# EAGLE schematic zikzak3-memswitch (EAGLE 6.4)
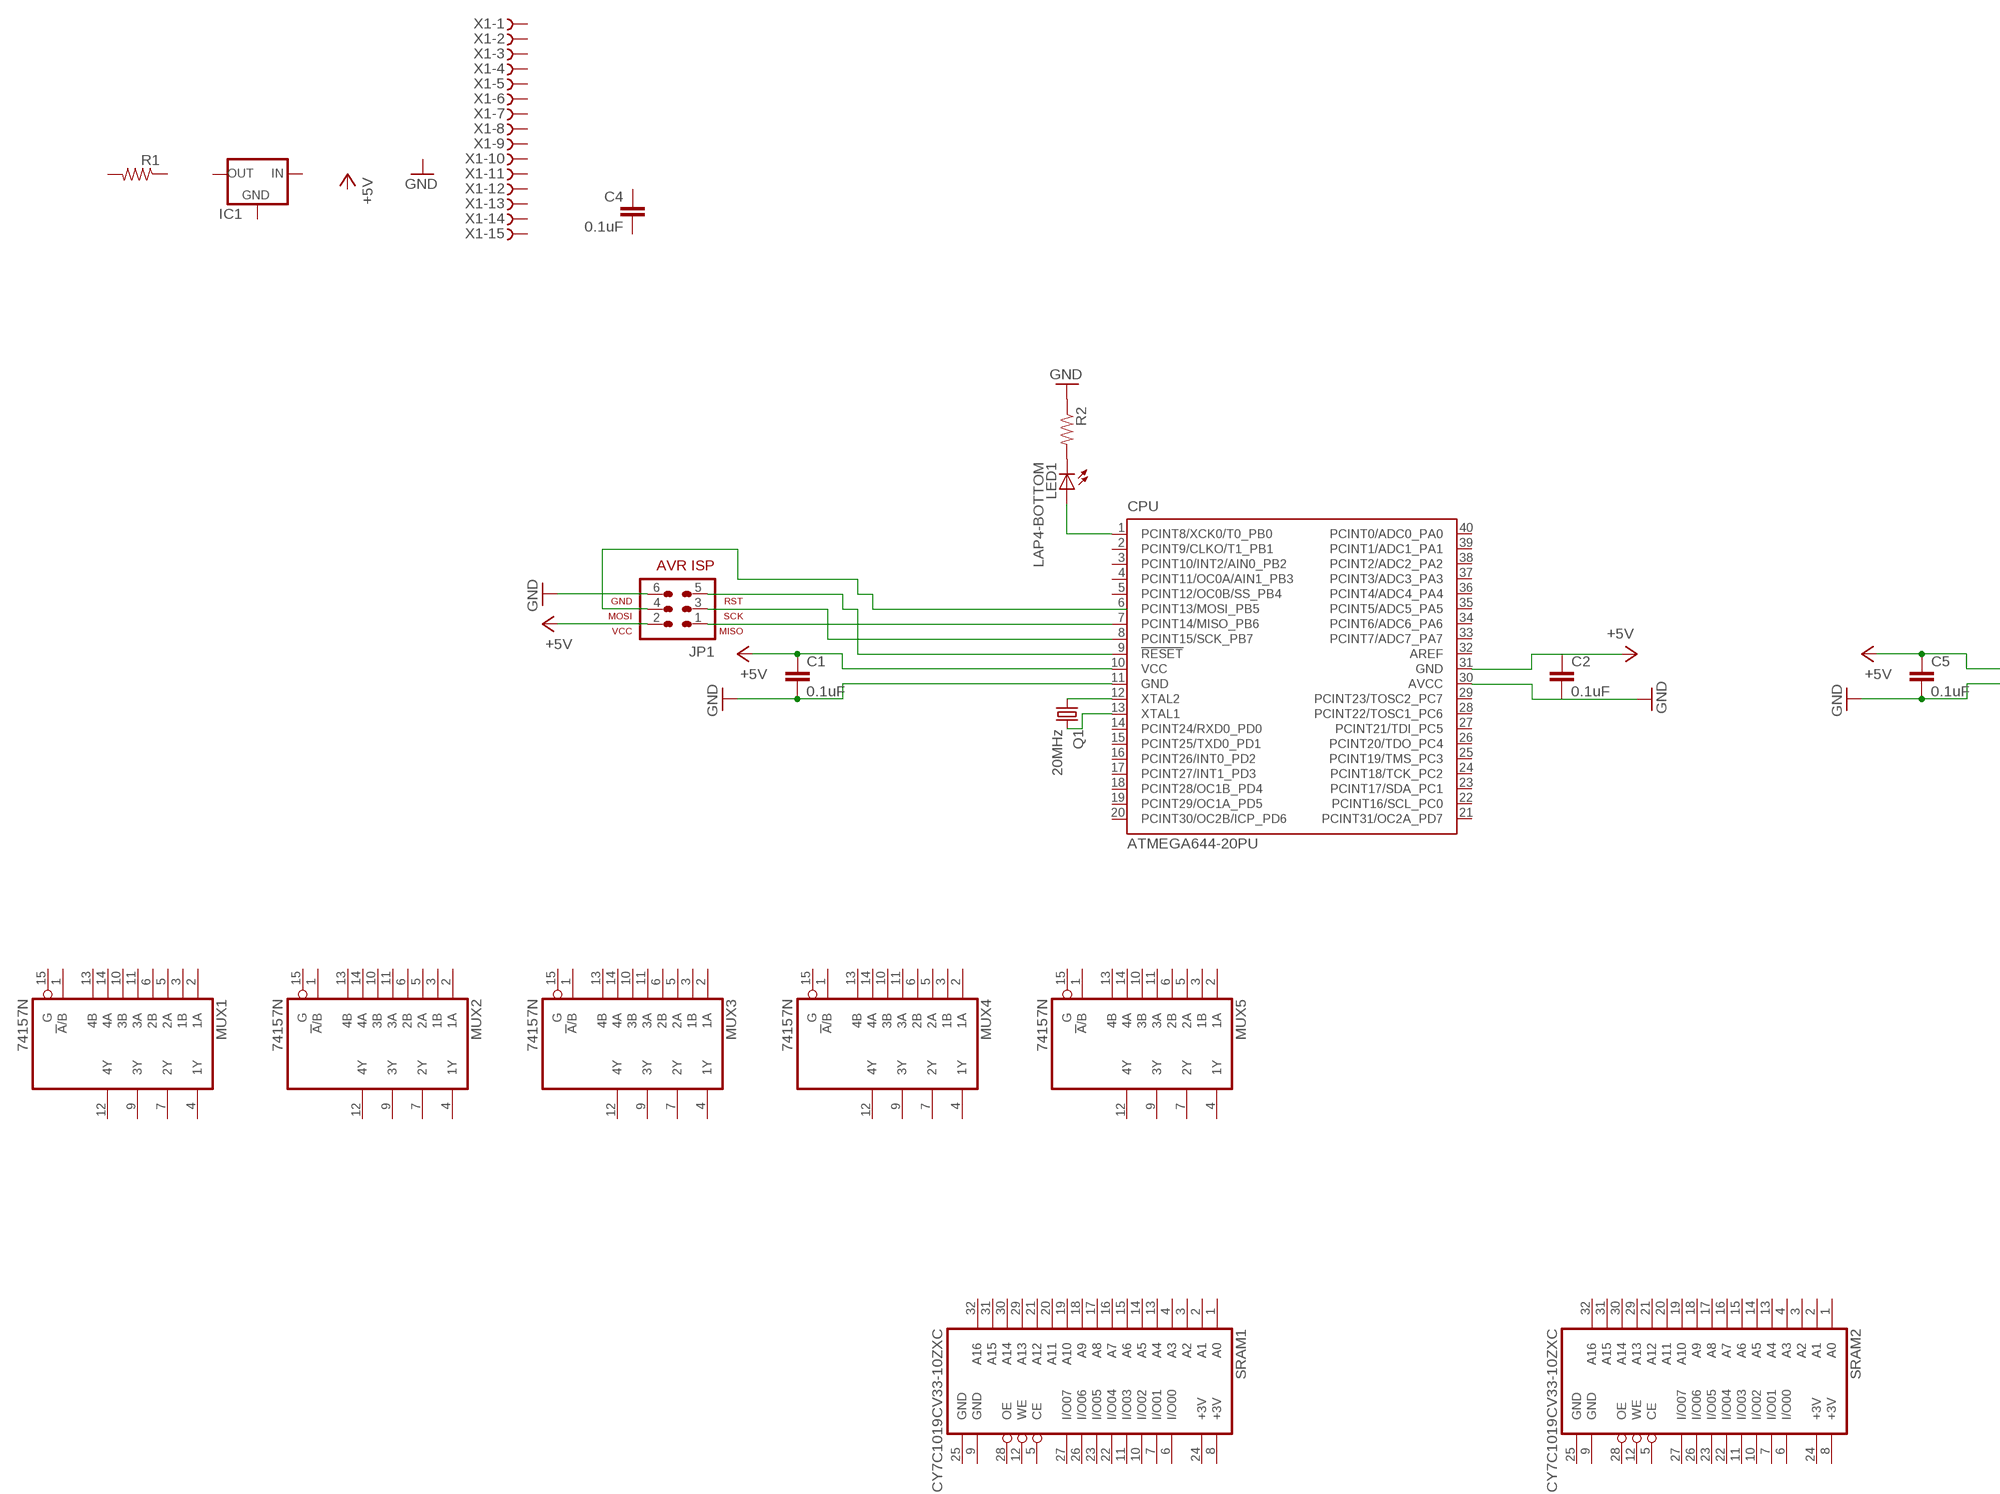
[diagram p0: schematic, sheet 1, part 1 of 2]
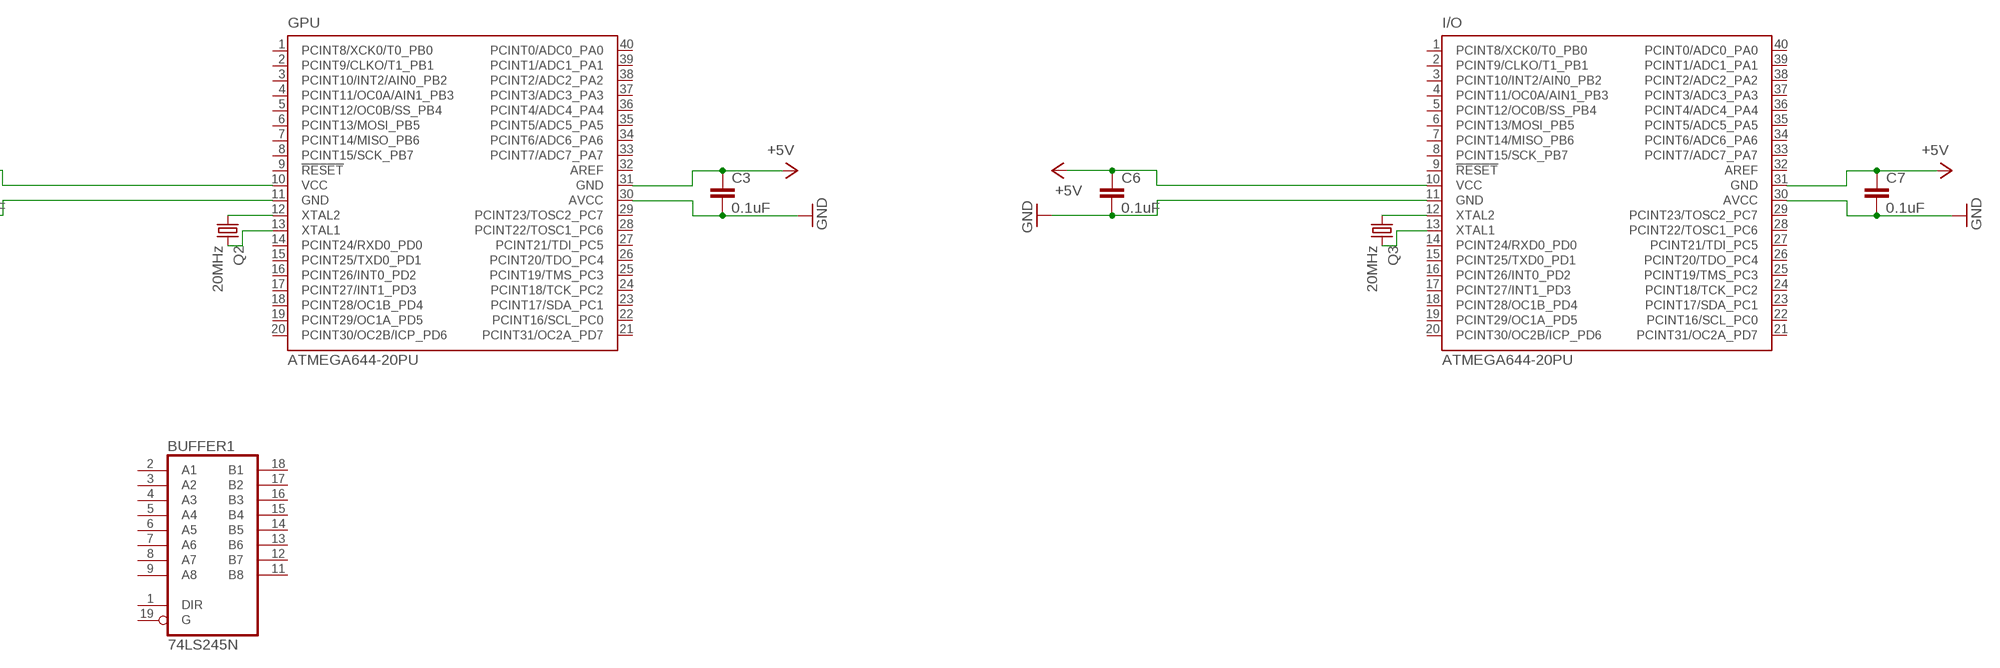
[diagram p1: schematic, sheet 1, part 2 of 2]

## Parts
BUFFER1  74LS245N  [DIL20]
C1  0.1uF  C2,5-3  [C2.5-3]
C2  0.1uF  C2,5-3  [C2.5-3]
C3  0.1uF  C2,5-3  [C2.5-3]
C4  0.1uF  C2,5-3  [C2.5-3]
C5  0.1uF  C2,5-3  [C2.5-3]
C6  0.1uF  C2,5-3  [C2.5-3]
C7  0.1uF  C2,5-3  [C2.5-3]
CPU  ATMEGA644-20PU  [DIL40]
GPU  ATMEGA644-20PU  [DIL40]
I/O  ATMEGA644-20PU  [DIL40]
IC1  78MXXL  [78MXXL]
JP1  AVR-ISP-6VERT  [AVR-ISP-6]
LED1  LAP4-BOTTOM  [P47F-BOTTOM]
MUX1  74157N  [DIL16]
MUX2  74157N  [DIL16]
MUX3  74157N  [DIL16]
MUX4  74157N  [DIL16]
MUX5  74157N  [DIL16]
Q1  20MHz  CRYSTALTC38H  [TC38H]
Q2  20MHz  CRYSTALTC38H  [TC38H]
Q3  20MHz  CRYSTALTC38H  [TC38H]
R1  R-US_0204/2V  [0204V]
R2  R-US_0204/2V  [0204V]
SRAM1  CY7C1019CV33-10ZXC  [TSOPII-32]
SRAM2  CY7C1019CV33-10ZXC  [TSOPII-32]
X1  F15HDVS  [HDF15V]

## Nets
+5V: C1.1 C3.1 C5.1 C6.1 C7.1 CPU.10(VCC) CPU.31(GND) GPU.10(VCC) GPU.31(GND) I/O.10(VCC) I/O.31(GND) JP1.2
GND: C1.2 C3.2 C5.2 C6.2 C7.2 CPU.11(GND) CPU.30(AVCC) GPU.11(GND) GPU.30(AVCC) I/O.11(GND) I/O.30(AVCC) JP1.6 R2.1
N$1: LED1.C R2.2
N$2: CPU.7(PCINT14/MISO_PB6) JP1.1
N$3: CPU.8(PCINT15/SCK_PB7) JP1.3
N$4: CPU.9(!RESET) JP1.5
N$5: CPU.12(XTAL2) Q1.1
N$6: CPU.13(XTAL1) Q1.2
N$7: CPU.1(PCINT8/XCK0/T0_PB0) LED1.A
N$8: JP1.4
N$9: GPU.12(XTAL2) Q2.1
N$10: GPU.13(XTAL1) Q2.2
N$11: I/O.12(XTAL2) Q3.1
N$12: I/O.13(XTAL1) Q3.2
Unconnected: BUFFER1.1(DIR) BUFFER1.2(A1) BUFFER1.3(A2) BUFFER1.4(A3) BUFFER1.5(A4) BUFFER1.6(A5) BUFFER1.7(A6) BUFFER1.8(A7) BUFFER1.9(A8) BUFFER1.11(B8) BUFFER1.12(B7) BUFFER1.13(B6) BUFFER1.14(B5) BUFFER1.15(B4) BUFFER1.16(B3) BUFFER1.17(B2) BUFFER1.18(B1) BUFFER1.19(G) C2.1 C2.2 C4.1 C4.2 CPU.2(PCINT9/CLKO/T1_PB1) CPU.3(PCINT10/INT2/AIN0_PB2) CPU.4(PCINT11/OC0A/AIN1_PB3) CPU.5(PCINT12/OC0B/SS_PB4) CPU.6(PCINT13/MOSI_PB5) CPU.14(PCINT24/RXD0_PD0) CPU.15(PCINT25/TXD0_PD1) CPU.16(PCINT26/INT0_PD2) CPU.17(PCINT27/INT1_PD3) CPU.18(PCINT28/OC1B_PD4) CPU.19(PCINT29/OC1A_PD5) CPU.20(PCINT30/OC2B/ICP_PD6) CPU.21(PCINT31/OC2A_PD7) CPU.22(PCINT16/SCL_PC0) CPU.23(PCINT17/SDA_PC1) CPU.24(PCINT18/TCK_PC2) CPU.25(PCINT19/TMS_PC3) CPU.26(PCINT20/TDO_PC4) CPU.27(PCINT21/TDI_PC5) CPU.28(PCINT22/TOSC1_PC6) CPU.29(PCINT23/TOSC2_PC7) CPU.32(AREF) CPU.33(PCINT7/ADC7_PA7) CPU.34(PCINT6/ADC6_PA6) CPU.35(PCINT5/ADC5_PA5) CPU.36(PCINT4/ADC4_PA4) CPU.37(PCINT3/ADC3_PA3) CPU.38(PCINT2/ADC2_PA2) CPU.39(PCINT1/ADC1_PA1) CPU.40(PCINT0/ADC0_PA0) GPU.1(PCINT8/XCK0/T0_PB0) GPU.2(PCINT9/CLKO/T1_PB1) GPU.3(PCINT10/INT2/AIN0_PB2) GPU.4(PCINT11/OC0A/AIN1_PB3) GPU.5(PCINT12/OC0B/SS_PB4) GPU.6(PCINT13/MOSI_PB5) GPU.7(PCINT14/MISO_PB6) GPU.8(PCINT15/SCK_PB7) GPU.9(!RESET) GPU.14(PCINT24/RXD0_PD0) GPU.15(PCINT25/TXD0_PD1) GPU.16(PCINT26/INT0_PD2) GPU.17(PCINT27/INT1_PD3) GPU.18(PCINT28/OC1B_PD4) GPU.19(PCINT29/OC1A_PD5) GPU.20(PCINT30/OC2B/ICP_PD6) GPU.21(PCINT31/OC2A_PD7) GPU.22(PCINT16/SCL_PC0) GPU.23(PCINT17/SDA_PC1) GPU.24(PCINT18/TCK_PC2) GPU.25(PCINT19/TMS_PC3) GPU.26(PCINT20/TDO_PC4) GPU.27(PCINT21/TDI_PC5) GPU.28(PCINT22/TOSC1_PC6) GPU.29(PCINT23/TOSC2_PC7) GPU.32(AREF) GPU.33(PCINT7/ADC7_PA7) GPU.34(PCINT6/ADC6_PA6) GPU.35(PCINT5/ADC5_PA5) GPU.36(PCINT4/ADC4_PA4) GPU.37(PCINT3/ADC3_PA3) GPU.38(PCINT2/ADC2_PA2) GPU.39(PCINT1/ADC1_PA1) GPU.40(PCINT0/ADC0_PA0) I/O.1(PCINT8/XCK0/T0_PB0) I/O.2(PCINT9/CLKO/T1_PB1) I/O.3(PCINT10/INT2/AIN0_PB2) I/O.4(PCINT11/OC0A/AIN1_PB3) I/O.5(PCINT12/OC0B/SS_PB4) I/O.6(PCINT13/MOSI_PB5) I/O.7(PCINT14/MISO_PB6) I/O.8(PCINT15/SCK_PB7) I/O.9(!RESET) I/O.14(PCINT24/RXD0_PD0) I/O.15(PCINT25/TXD0_PD1) I/O.16(PCINT26/INT0_PD2) I/O.17(PCINT27/INT1_PD3) I/O.18(PCINT28/OC1B_PD4) I/O.19(PCINT29/OC1A_PD5) I/O.20(PCINT30/OC2B/ICP_PD6) I/O.21(PCINT31/OC2A_PD7) I/O.22(PCINT16/SCL_PC0) I/O.23(PCINT17/SDA_PC1) I/O.24(PCINT18/TCK_PC2) I/O.25(PCINT19/TMS_PC3) I/O.26(PCINT20/TDO_PC4) I/O.27(PCINT21/TDI_PC5) I/O.28(PCINT22/TOSC1_PC6) I/O.29(PCINT23/TOSC2_PC7) I/O.32(AREF) I/O.33(PCINT7/ADC7_PA7) I/O.34(PCINT6/ADC6_PA6) I/O.35(PCINT5/ADC5_PA5) I/O.36(PCINT4/ADC4_PA4) I/O.37(PCINT3/ADC3_PA3) I/O.38(PCINT2/ADC2_PA2) I/O.39(PCINT1/ADC1_PA1) I/O.40(PCINT0/ADC0_PA0) IC1.GND IC1.IN IC1.OUT MUX1.1(!A!/B) MUX1.2(1A) MUX1.3(1B) MUX1.4(1Y) MUX1.5(2A) MUX1.6(2B) MUX1.7(2Y) MUX1.9(3Y) MUX1.10(3B) MUX1.11(3A) MUX1.12(4Y) MUX1.13(4B) MUX1.14(4A) MUX1.15(G) MUX2.1(!A!/B) MUX2.2(1A) MUX2.3(1B) MUX2.4(1Y) MUX2.5(2A) MUX2.6(2B) MUX2.7(2Y) MUX2.9(3Y) MUX2.10(3B) MUX2.11(3A) MUX2.12(4Y) MUX2.13(4B) MUX2.14(4A) MUX2.15(G) MUX3.1(!A!/B) MUX3.2(1A) MUX3.3(1B) MUX3.4(1Y) MUX3.5(2A) MUX3.6(2B) MUX3.7(2Y) MUX3.9(3Y) MUX3.10(3B) MUX3.11(3A) MUX3.12(4Y) MUX3.13(4B) MUX3.14(4A) MUX3.15(G) MUX4.1(!A!/B) MUX4.2(1A) MUX4.3(1B) MUX4.4(1Y) MUX4.5(2A) MUX4.6(2B) MUX4.7(2Y) MUX4.9(3Y) MUX4.10(3B) MUX4.11(3A) MUX4.12(4Y) MUX4.13(4B) MUX4.14(4A) MUX4.15(G) MUX5.1(!A!/B) MUX5.2(1A) MUX5.3(1B) MUX5.4(1Y) MUX5.5(2A) MUX5.6(2B) MUX5.7(2Y) MUX5.9(3Y) MUX5.10(3B) MUX5.11(3A) MUX5.12(4Y) MUX5.13(4B) MUX5.14(4A) MUX5.15(G) R1.1 R1.2 SRAM1.1(A0) SRAM1.2(A1) SRAM1.3(A2) SRAM1.4(A3) SRAM1.5(CE) SRAM1.6(I/O00) SRAM1.7(I/O01) SRAM1.10(I/O02) SRAM1.11(I/O03) SRAM1.12(WE) SRAM1.13(A4) SRAM1.14(A5) SRAM1.15(A6) SRAM1.16(A7) SRAM1.17(A8) SRAM1.18(A9) SRAM1.19(A10) SRAM1.20(A11) SRAM1.21(A12) SRAM1.22(I/O04) SRAM1.23(I/O05) SRAM1.26(I/O06) SRAM1.27(I/O07) SRAM1.28(OE) SRAM1.29(A13) SRAM1.30(A14) SRAM1.31(A15) SRAM1.32(A16) SRAM2.1(A0) SRAM2.2(A1) SRAM2.3(A2) SRAM2.4(A3) SRAM2.5(CE) SRAM2.6(I/O00) SRAM2.7(I/O01) SRAM2.10(I/O02) SRAM2.11(I/O03) SRAM2.12(WE) SRAM2.13(A4) SRAM2.14(A5) SRAM2.15(A6) SRAM2.16(A7) SRAM2.17(A8) SRAM2.18(A9) SRAM2.19(A10) SRAM2.20(A11) SRAM2.21(A12) SRAM2.22(I/O04) SRAM2.23(I/O05) SRAM2.26(I/O06) SRAM2.27(I/O07) SRAM2.28(OE) SRAM2.29(A13) SRAM2.30(A14) SRAM2.31(A15) SRAM2.32(A16) X1.1 X1.2 X1.3 X1.4 X1.5 X1.6 X1.7 X1.8 X1.9 X1.10 X1.11 X1.12 X1.13 X1.14 X1.15

## Power pins joined to a net without a drawn wire
+3V: SRAM1.8(+3V) SRAM1.24(+3V) SRAM2.8(+3V) SRAM2.24(+3V)
GND: BUFFER1.10(GND) MUX1.8(GND) MUX2.8(GND) MUX3.8(GND) MUX4.8(GND) MUX5.8(GND) SRAM1.9(GND) SRAM1.25(GND) SRAM2.9(GND) SRAM2.25(GND)
VCC: BUFFER1.20(VCC) MUX1.16(VCC) MUX2.16(VCC) MUX3.16(VCC) MUX4.16(VCC) MUX5.16(VCC)

## Library data of the parts
BUFFER1 = 74xx-us:74*245: Octal BUS TRANSCEIVER, 3-state
C1-C7 = capacitor-wima:C: CAPACITOR naming: grid - package width
CPU GPU I/O = atmel:ATMEGA644-*PU: 8-bit Microcontroller with 64K Bytes In-System Programmable Flash Auto generated by make-symbol-device-package-bsdl.ulp Rev. 34 Source: http://www.atmel.com/dyn/resources/prod_documents/doc2593.pdf; MPN: ATMEGA644-20PU; OC_FARNELL: 1288340; OC_NEWARK: 23M5060
IC1 = v-reg:78MXXL: VOLTAGE REGULATOR
JP1 = avr-7:AVR-ISP-6: AVR ISP-6 Serial Programming Header
LED1 = led:*P4: PointLED® Enhanced Thinfilm LED TOP & BOTTOM mount LS P47F, LR P47F, LA P47F, LY P47F, LT P4SG, LB P4SG, LW P4SG Source: http://catalog.osram-os.com .. LA_LR_LS_LY_P47F_Pb_free.pdf
MUX1-MUX5 = 74xx-us:74*157: Quadruple 2-line to 1-line data SELECTOR/MULTIPLEXER
Q1-Q3 = crystal:CRYSTAL: CRYSTAL; OC_FARNELL: unknown; OC_NEWARK: unknown
R1 R2 = rcl:R-US_: RESISTOR, American symbol
SRAM1 SRAM2 = memory-sram:CY7C1019CV33: 128K x 8 Static RAM 10ns Source: Cypress CYP05780611.pdf
X1 = con-subd:F15?S: SUB-D; OC_FARNELL: unknown; OC_NEWARK: unknown